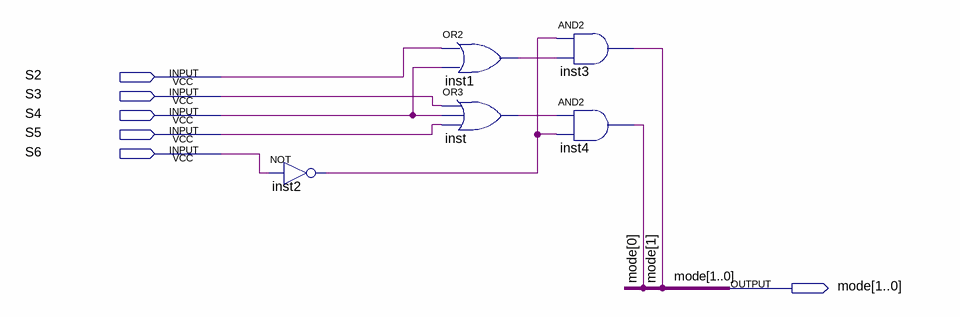
[diagram p0: schematic sheet]
// Quartus schematic mode_selector.bdf as structural Verilog: 5 symbols, 6 pins
module mode_selector (
  input  S2,
  input  S3,
  input  S4,
  input  S5,
  input  S6,
  output [1:0] mode
);

  wire inst1_out, inst2_out, inst_out;

  not inst2 (inst2_out, S6);
  or inst1 (inst1_out, S2, S4);
  or inst (inst_out, S3, S4, S5);
  and inst3 (mode[1], inst2_out, inst1_out);
  and inst4 (mode[0], inst_out, inst2_out);
endmodule
